# Altium schematic sheet pca10090_sheet5_signal_switches.SchDoc: PCA10090 - Signal switches
size A3; Organization: Nordic Semiconductor; DocumentNumber: 5; SheetNumber: 5; SheetTotal: 8; CompanyName: Nordic Semiconductor; DocumentSize: A3
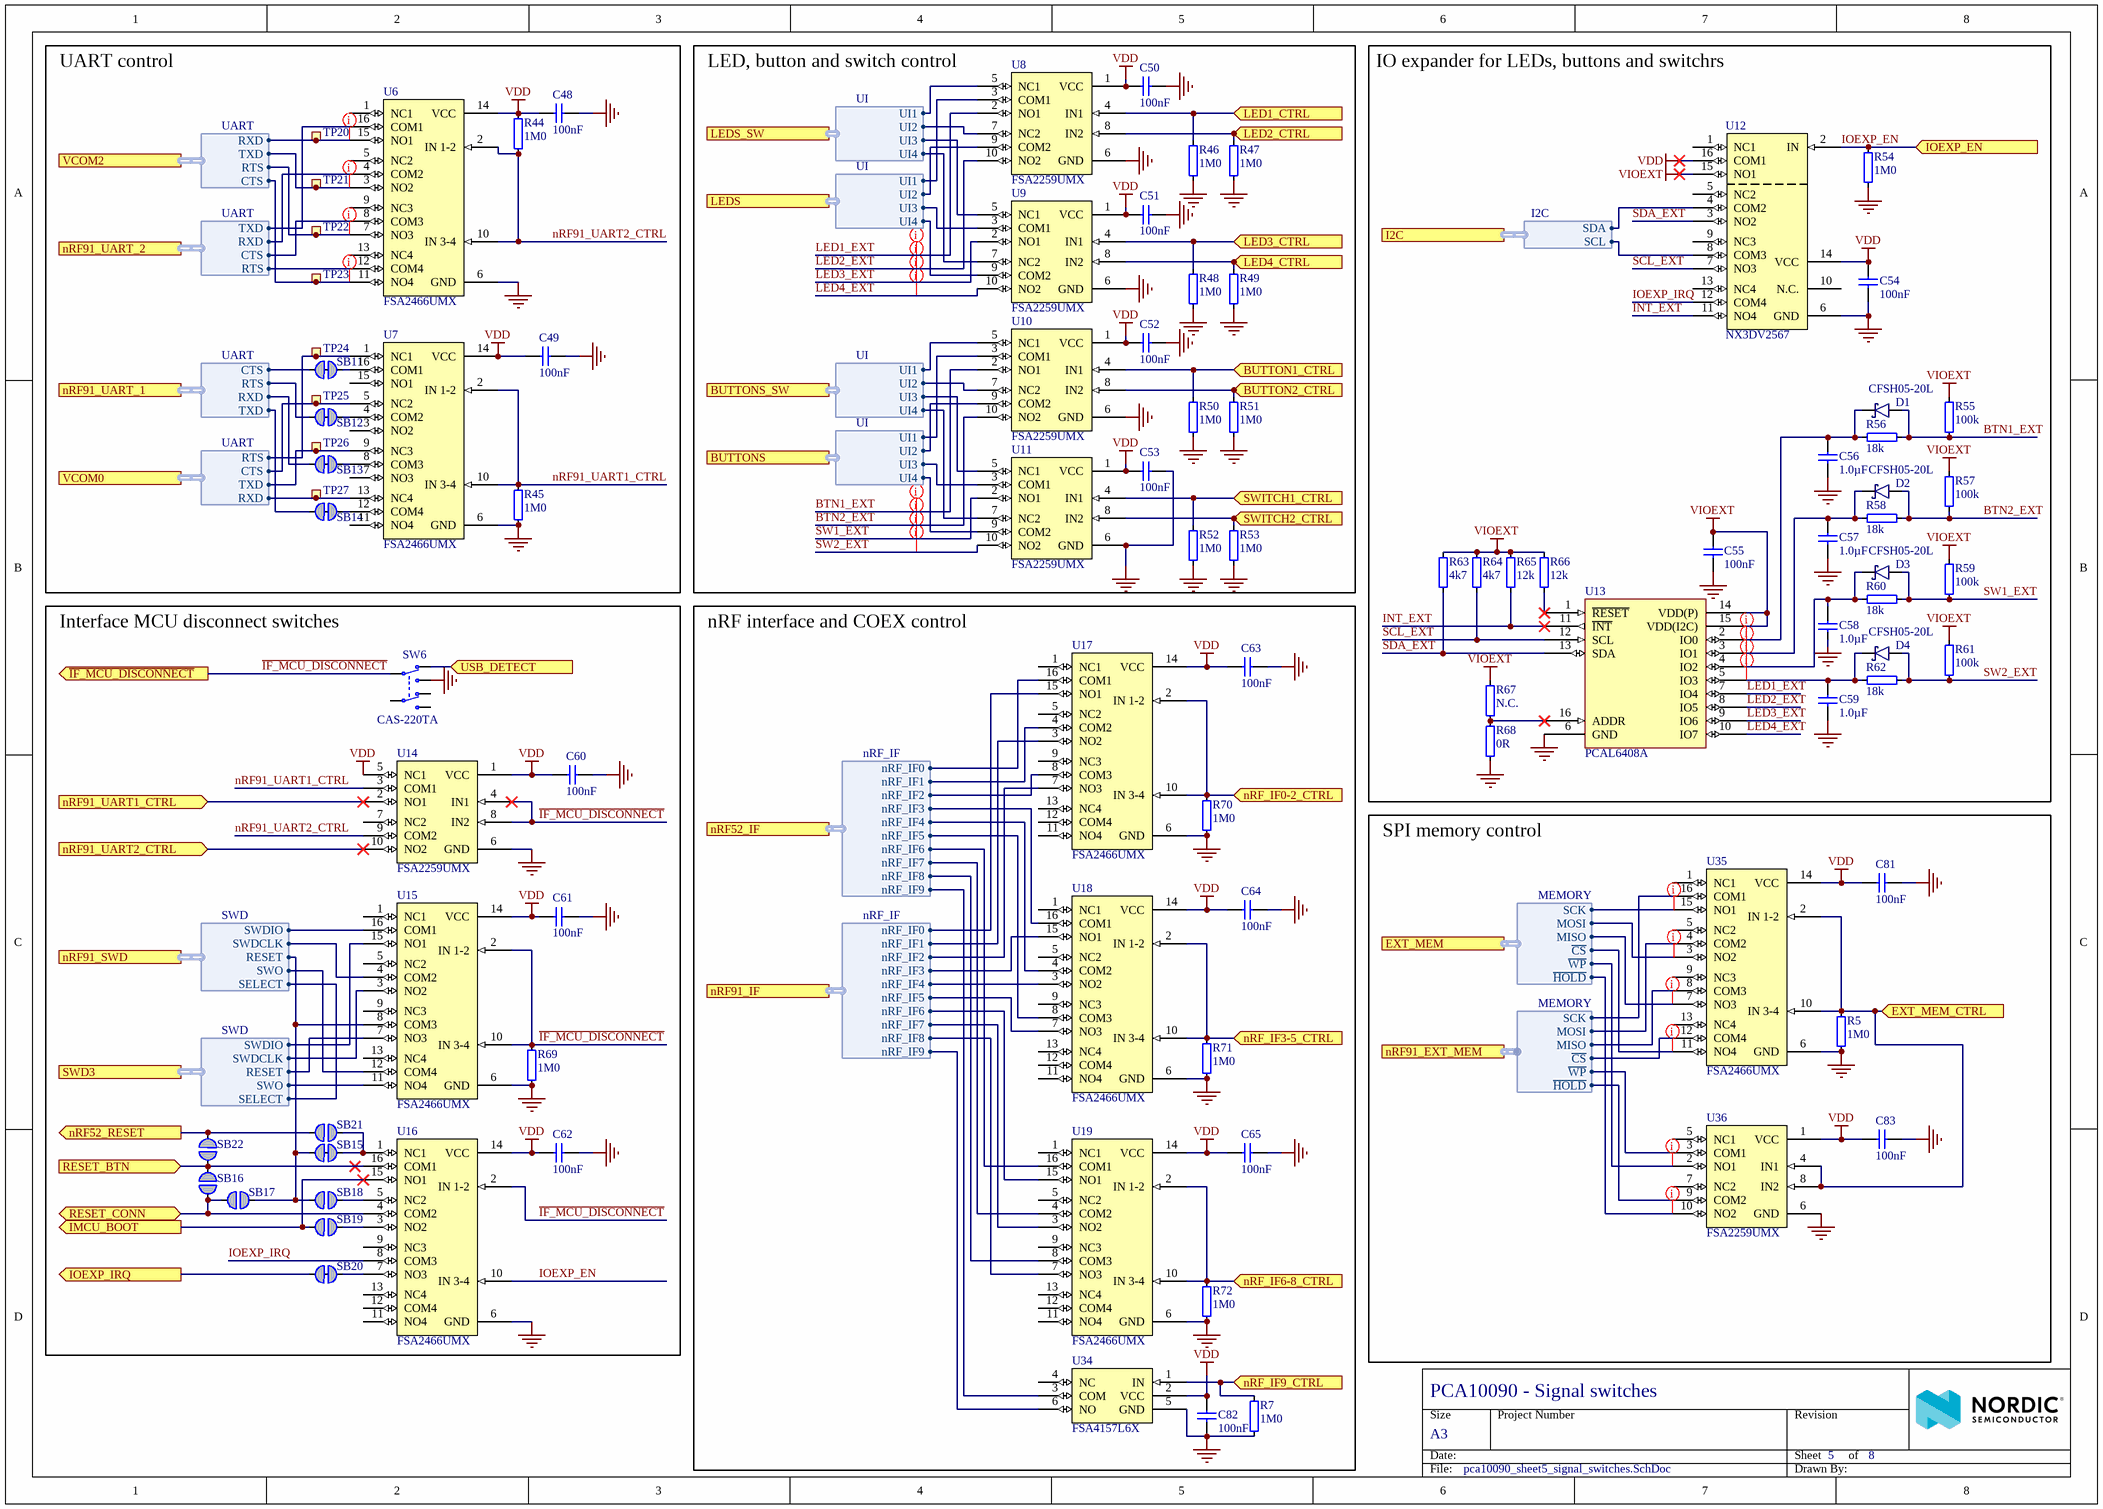
[diagram p0: pca10090_sheet5_signal_switches.SchDoc]

## Parts
C48  100nF  [CAPC0603X03L_C]
C49  100nF  [CAPC0603X03L_C]
C50  100nF  [CAPC0603X03L_C]
C51  100nF  [CAPC0603X03L_C]
C52  100nF  [CAPC0603X03L_C]
C53  100nF  [CAPC0603X03L_C]
C54  100nF  [CAPC0603X03L_C]
C55  100nF  [CAPC0603X03L_C]
C56  1.0µF  [CAPC0603X03L_C]
C57  1.0µF  [CAPC0603X03L_C]
C58  1.0µF  [CAPC0603X03L_C]
C59  1.0µF  [CAPC0603X03L_C]
C60  100nF  [CAPC0603X03L_C]
C61  100nF  [CAPC0603X03L_C]
C62  100nF  [CAPC0603X03L_C]
C63  100nF  [CAPC0603X03L_C]
C64  100nF  [CAPC0603X03L_C]
C65  100nF  [CAPC0603X03L_C]
C81  100nF  [CAPC0603X03L_C]
C82  100nF  [CAPC0603X03L_C]
C83  100nF  [CAPC0603X03L_C]
D1  CFSH05-20L  [SODFL35X40-2N]
D2  CFSH05-20L  [SODFL35X40-2N]
D3  CFSH05-20L  [SODFL35X40-2N]
D4  CFSH05-20L  [SODFL35X40-2N]
R5  1M0  [RESC0603X03L_C]
R7  1M0  [RESC0603X03L_C]
R44  1M0  [RESC0603X03L_C]
R45  1M0  [RESC0603X03L_C]
R46  1M0  [RESC0603X03L_C]
R47  1M0  [RESC0603X03L_C]
R48  1M0  [RESC0603X03L_C]
R49  1M0  [RESC0603X03L_C]
R50  1M0  [RESC0603X03L_C]
R51  1M0  [RESC0603X03L_C]
R52  1M0  [RESC0603X03L_C]
R53  1M0  [RESC0603X03L_C]
R54  1M0  [RESC0603X03L_C]
R55  100k  [RESC0603X03L_C]
R56  18k  [RESC0603X03L_C]
R57  100k  [RESC0603X03L_C]
R58  18k  [RESC0603X03L_C]
R59  100k  [RESC0603X03L_C]
R60  18k  [RESC0603X03L_C]
R61  100k  [RESC0603X03L_C]
R62  18k  [RESC0603X03L_C]
R63  4k7  [RESC0603X03L_C]
R64  4k7  [RESC0603X03L_C]
R65  12k  [RESC0603X03L_C]
R66  12k  [RESC0603X03L_C]
R67  N.C.  [RESC0603X03L_C_NC]
R68  0R  [RESC0603X03L_C]
R69  1M0  [RESC0603X03L_C]
R70  1M0  [RESC0603X03L_C]
R71  1M0  [RESC0603X03L_C]
R72  1M0  [RESC0603X03L_C]
SB11  Solderbridge  [Solderbridge_Shorted]  (value not drawn)  (net tie, no BOM)
SB12  Solderbridge  [Solderbridge_Shorted]  (value not drawn)  (net tie, no BOM)
SB13  Solderbridge  [Solderbridge_Shorted]  (value not drawn)  (net tie, no BOM)
SB14  Solderbridge  [Solderbridge_Shorted]  (value not drawn)  (net tie, no BOM)
SB15  Solderbridge  [Solderbridge_Shorted]  (value not drawn)  (net tie, no BOM)
SB16  Solderbridge  [Solderbridge]  (value not drawn)  (no BOM)
SB17  Solderbridge  [Solderbridge]  (value not drawn)  (no BOM)
SB18  Solderbridge  [Solderbridge]  (value not drawn)  (no BOM)
SB19  Solderbridge  [Solderbridge]  (value not drawn)  (no BOM)
SB20  Solderbridge  [Solderbridge_Shorted]  (value not drawn)  (net tie, no BOM)
SB21  Solderbridge  [Solderbridge]  (value not drawn)  (no BOM)
SB22  Solderbridge  [Solderbridge]  (value not drawn)  (no BOM)
SW6  CAS-220TA  [CAS-220TA]
TP20  Ø1.5mm,SMD  [TP_SMD_Ø1.5mm]  (value not drawn)  (no BOM)
TP21  Ø1.5mm,SMD  [TP_SMD_Ø1.5mm]  (value not drawn)  (no BOM)
TP22  Ø1.5mm,SMD  [TP_SMD_Ø1.5mm]  (value not drawn)  (no BOM)
TP23  Ø1.5mm,SMD  [TP_SMD_Ø1.5mm]  (value not drawn)  (no BOM)
TP24  Ø1.5mm,SMD  [TP_SMD_Ø1.5mm]  (value not drawn)  (no BOM)
TP25  Ø1.5mm,SMD  [TP_SMD_Ø1.5mm]  (value not drawn)  (no BOM)
TP26  Ø1.5mm,SMD  [TP_SMD_Ø1.5mm]  (value not drawn)  (no BOM)
TP27  Ø1.5mm,SMD  [TP_SMD_Ø1.5mm]  (value not drawn)  (no BOM)
U6  FSA2466UMX  [XQFN40P180X260X50-16N]
U7  FSA2466UMX  [XQFN40P180X260X50-16N]
U8  FSA2259UMX  [UFQFN40P140X180X55-10N]
U9  FSA2259UMX  [UFQFN40P140X180X55-10N]
U10  FSA2259UMX  [UFQFN40P140X180X55-10N]
U11  FSA2259UMX  [UFQFN40P140X180X55-10N]
U12  NX3DV2567  [XQFN40P180X260X50-16N]
U13  PCAL6408A  [XQFN40P180X260X50-16N]
U14  FSA2259UMX  [UFQFN40P140X180X55-10N]
U15  FSA2466UMX  [XQFN40P180X260X50-16N]
U16  FSA2466UMX  [XQFN40P180X260X50-16N]
U17  FSA2466UMX  [XQFN40P180X260X50-16N]
U18  FSA2466UMX  [XQFN40P180X260X50-16N]
U19  FSA2466UMX  [XQFN40P180X260X50-16N]
U34  FSA4157L6X  [PSON50P100X60-6N]
U35  FSA2466UMX  [XQFN40P180X260X50-16N]
U36  FSA2259UMX  [UFQFN40P140X180X55-10N]

## Blocks framed on the sheet
UART control: C48 C49 R44 R45 SB11-SB14 TP20-TP27 U6 U7
LED, button and switch control: C50-C53 R46-R53 U8-U11
IO expander for LEDs, buttons and switchrs: C54-C59 D1-D4 R54-R68 U12 U13
Interface MCU disconnect switches: C60-C62 R69 SB15-SB22 SW6 U14-U16
nRF interface and COEX control: C63-C65 C82 R7 R70-R72 U17-U19 U34
SPI memory control: C81 C83 R5 U35 U36

## Ports
BUTTON1_CTRL (in), BUTTON2_CTRL (in), BUTTONS (harness UI), BUTTONS_SW (harness UI), EXT_MEM (harness MEMORY), EXT_MEM_CTRL (in), I2C (harness I2C), IMCU_BOOT (out), IOEXP_EN (in), IOEXP_IRQ (out), LED1_CTRL (in), LED2_CTRL (in), LED3_CTRL (in), LED4_CTRL (in), LEDS (harness UI), LEDS_SW (harness UI), nRF52_IF (harness nRF_IF), nRF52_RESET (out), nRF91_EXT_MEM (harness MEMORY), nRF91_IF (harness nRF_IF), nRF91_SWD (harness SWD), nRF91_UART1_CTRL (in), nRF91_UART2_CTRL (in), nRF91_UART_1 (harness UART), nRF91_UART_2 (harness UART), nRF_IF0-2_CTRL (in), nRF_IF3-5_CTRL (in), nRF_IF6-8_CTRL (in), nRF_IF9_CTRL (in), RESET_BTN (in), RESET_CONN (bidir), SWD3 (harness SWD), SWITCH1_CTRL (in), SWITCH2_CTRL (in), USB_DETECT (in), VCOM0 (harness UART), VCOM2 (harness UART), ~{IF_MCU_DISCONNECT} (out)

## Harnesses
nRF_IF: nRF_IF0, nRF_IF1, nRF_IF2, nRF_IF3, nRF_IF4, nRF_IF5, nRF_IF6, nRF_IF7, nRF_IF8, nRF_IF9
SWD: SWDIO, SWDCLK, SWO, RESET, SELECT
UART: RTS, CTS, RXD, TXD
UI: UI4, UI3, UI2, UI1
I2C: SCL, SDA
MEMORY: SCK, ~{CS}, MOSI, MISO, ~{WP}, ~{HOLD}

## Nets
GND: C48.2 C49.2 C50.2 C51.2 C52.2 C53.2 C54.1 C55.1 C56.2 C57.1 C58.1 C59.1 C60.2 C61.2 C62.2 C63.2 C64.2 C65.2 C81.2 C82.2 C83.2 R5.1 R7.1 R45.1 R46.1 R47.1 R48.1 R49.1 R50.1 R51.1 R52.1 R53.1 R54.1 R68.1 R69.1 R70.1 R71.1 R72.1 SW6.1(N.O-1) U6.6(GND) U7.6(GND) U8.6(GND) U9.6(GND) U10.6(GND) U11.6(GND) U12.6(GND) U13.6(GND) U14.6(GND) U15.6(GND) U16.6(GND) U17.6(GND) U18.6(GND) U19.6(GND) U34.5(GND) U35.6(GND) U36.6(GND)
VDD: C48.1 C49.1 C50.1 C51.1 C52.1 C53.1 C54.2 C60.1 C61.1 C62.1 C63.1 C64.1 C65.1 C81.1 C82.1 C83.1 R44.1 U6.14(VCC) U7.14(VCC) U8.1(VCC) U9.1(VCC) U10.1(VCC) U11.1(VCC) U12.14(VCC) U12.16(COM1) U14.1(VCC) U14.5(NC1) U15.14(VCC) U16.14(VCC) U17.14(VCC) U18.14(VCC) U19.14(VCC) U34.2(VCC) U35.14(VCC) U36.1(VCC)
VIOEXT: C55.2 R55.2 R57.2 R59.2 R61.2 R63.2 R64.2 R65.2 R66.2 R67.2 U12.15(NO1) U13.14(VDD(P)) U13.15(VDD(I2C))
BTN1_EXT: D1.1(A) R55.1 R56.2 U10.2(NO1)
BTN2_EXT: D2.1(A) R57.1 R58.2 U10.10(NO2)
BUTTON1_CTRL: R50.2 U10.4(IN1) ; port BUTTON1_CTRL
BUTTON2_CTRL: R51.2 U10.8(IN2) ; port BUTTON2_CTRL
EXT_MEM_CTRL: R5.2 U35.2(IN_1-2) U35.10(IN_3-4) U36.4(IN1) U36.8(IN2) ; port EXT_MEM_CTRL
~{IF_MCU_DISCONNECT}: R69.2 SW6.2(COM-1) U14.4(IN1) U14.8(IN2) U15.2(IN_1-2) U15.10(IN_3-4) U16.2(IN_1-2) ; port ~{IF_MCU_DISCONNECT}
IMCU_BOOT: SB19.2 U16.15(NO1) ; port IMCU_BOOT
INT_EXT: R65.1 U12.11(NO4) U13.11(~{INT})
IOEXP_EN: R54.2 U12.2(IN) U16.10(IN_3-4) ; port IOEXP_EN
IOEXP_IRQ: U12.12(COM4) U16.8(COM3)
IOEXP_IRQ: SB20.2 ; port IOEXP_IRQ  [a separate net that carries the same name]
LED1_CTRL: R46.2 U8.4(IN1) ; port LED1_CTRL
LED1_EXT: U8.2(NO1) U13.7(IO4)
LED2_CTRL: R47.2 U8.8(IN2) ; port LED2_CTRL
LED2_EXT: U8.10(NO2) U13.8(IO5)
LED3_CTRL: R48.2 U9.4(IN1) ; port LED3_CTRL
LED3_EXT: U9.2(NO1) U13.9(IO6)
LED4_CTRL: R49.2 U9.8(IN2) ; port LED4_CTRL
LED4_EXT: U9.10(NO2) U13.10(IO7)
nRF52_RESET: SB21.1 SB22.2 ; port nRF52_RESET
nRF91_UART1_CTRL: U14.2(NO1) ; port nRF91_UART1_CTRL
nRF91_UART1_CTRL: R45.2 U7.2(IN_1-2) U7.10(IN_3-4) U14.3(COM1)  [a separate net that carries the same name]
nRF91_UART2_CTRL: R44.2 U6.2(IN_1-2) U6.10(IN_3-4) U14.9(COM2)
nRF91_UART2_CTRL: U14.10(NO2) ; port nRF91_UART2_CTRL  [a separate net that carries the same name]
nRF_IF0-2_CTRL: R70.2 U17.2(IN_1-2) U17.10(IN_3-4) ; port nRF_IF0-2_CTRL
nRF_IF3-5_CTRL: R71.2 U18.2(IN_1-2) U18.10(IN_3-4) ; port nRF_IF3-5_CTRL
nRF_IF6-8_CTRL: R72.2 U19.2(IN_1-2) U19.10(IN_3-4) ; port nRF_IF6-8_CTRL
nRF_IF9_CTRL: R7.2 U34.1(IN) ; port nRF_IF9_CTRL
RESET_BTN: SB16.1 SB22.1 U16.16(COM1) ; port RESET_BTN
RESET_CONN: SB16.2 SB17.1 U16.4(COM2) ; port RESET_CONN
SCL_EXT: R64.1 U12.7(NO3) U13.12(SCL)
SDA_EXT: R63.1 U12.3(NO2) U13.13(SDA)
SW1_EXT: D3.1(A) R59.1 R60.2 U11.2(NO1)
SW2_EXT: D4.1(A) R61.1 R62.2 U11.10(NO2)
SWITCH1_CTRL: R52.2 U11.4(IN1) ; port SWITCH1_CTRL
SWITCH2_CTRL: R53.2 U11.8(IN2) ; port SWITCH2_CTRL
USB_DETECT: SW6.3(N.C-1) ; port USB_DETECT
NetC56_1: C56.1 D1.3(C) R56.1 U13.2(IO0)
NetC57_2: C57.2 D2.3(C) R58.1 U13.3(IO1)
NetC58_2: C58.2 D3.3(C) R60.1 U13.4(IO2)
NetC59_2: C59.2 D4.3(C) R62.1 U13.5(IO3)
NetR66_1: R66.1 U13.1(~{RESET})
NetR67_1: R67.1 R68.2 U13.16(ADDR)
NetSB11_1: SB11.1 ; port nRF91_UART_1.CTS
NetSB11_2: SB11.2 U7.16(COM1)
NetSB12_1: SB12.1 ; port nRF91_UART_1.RTS
NetSB12_2: SB12.2 U7.4(COM2)
NetSB13_1: SB13.1 ; port nRF91_UART_1.RXD
NetSB13_2: SB13.2 U7.8(COM3)
NetSB14_1: SB14.1 ; port nRF91_UART_1.TXD
NetSB14_2: SB14.2 U7.12(COM4)
NetSB15_1: SB15.1 SB21.2 U16.1(NC1)
NetSB15_2: SB15.2 SB17.2 SB18.2 U15.8(COM3) ; port nRF91_SWD.RESET
NetSB18_1: SB18.1 U16.5(NC2)
NetSB19_1: SB19.1 U16.3(NO2)
NetSB20_1: SB20.1 U16.7(NO3)
NetTP20_1: TP20.1 U6.15(NO1) ; port VCOM2.RXD
NetTP21_1: TP21.1 U6.3(NO2) ; port VCOM2.TXD
NetTP22_1: TP22.1 U6.7(NO3) ; port VCOM2.RTS
NetTP23_1: TP23.1 U6.11(NO4) ; port VCOM2.CTS
NetTP24_1: TP24.1 U7.1(NC1) ; port VCOM0.RTS
NetTP25_1: TP25.1 U7.5(NC2) ; port VCOM0.CTS
NetTP26_1: TP26.1 U7.9(NC3) ; port VCOM0.TXD
NetTP27_1: TP27.1 U7.13(NC4) ; port VCOM0.RXD
NetU6_4: U6.4(COM2) ; port nRF91_UART_2.RXD
NetU6_8: U6.8(COM3) ; port nRF91_UART_2.CTS
NetU6_12: U6.12(COM4) ; port nRF91_UART_2.RTS
NetU6_16: U6.16(COM1) ; port nRF91_UART_2.TXD
NetU8_3: U8.3(COM1) ; port LEDS.UI1
NetU8_5: U8.5(NC1) ; port LEDS_SW.UI1
NetU8_7: U8.7(NC2) ; port LEDS_SW.UI2
NetU8_9: U8.9(COM2) ; port LEDS.UI2
NetU9_3: U9.3(COM1) ; port LEDS.UI3
NetU9_5: U9.5(NC1) ; port LEDS_SW.UI3
NetU9_7: U9.7(NC2) ; port LEDS_SW.UI4
NetU9_9: U9.9(COM2) ; port LEDS.UI4
NetU10_3: U10.3(COM1) ; port BUTTONS.UI1
NetU10_5: U10.5(NC1) ; port BUTTONS_SW.UI1
NetU10_7: U10.7(NC2) ; port BUTTONS_SW.UI2
NetU10_9: U10.9(COM2) ; port BUTTONS.UI2
NetU11_3: U11.3(COM1) ; port BUTTONS.UI3
NetU11_5: U11.5(NC1) ; port BUTTONS_SW.UI3
NetU11_7: U11.7(NC2) ; port BUTTONS_SW.UI4
NetU11_9: U11.9(COM2) ; port BUTTONS.UI4
NetU12_4: U12.4(COM2) ; port I2C.SDA
NetU12_8: U12.8(COM3) ; port I2C.SCL
NetU15_3: U15.3(NO2) ; port SWD3.SWDCLK
NetU15_4: U15.4(COM2) ; port nRF91_SWD.SWDCLK
NetU15_7: U15.7(NO3) ; port SWD3.RESET
NetU15_11: U15.11(NO4) ; port SWD3.SWO
NetU15_12: U15.12(COM4) ; port nRF91_SWD.SWO
NetU15_15: U15.15(NO1) ; port SWD3.SWDIO
NetU15_16: U15.16(COM1) ; port nRF91_SWD.SWDIO
NetU17_3: U17.3(NO2) ; port nRF91_IF.nRF_IF1
NetU17_4: U17.4(COM2) ; port nRF52_IF.nRF_IF1
NetU17_7: U17.7(NO3) ; port nRF91_IF.nRF_IF2
NetU17_8: U17.8(COM3) ; port nRF52_IF.nRF_IF2
NetU17_15: U17.15(NO1) ; port nRF91_IF.nRF_IF0
NetU17_16: U17.16(COM1) ; port nRF52_IF.nRF_IF0
NetU18_3: U18.3(NO2) ; port nRF91_IF.nRF_IF4
NetU18_4: U18.4(COM2) ; port nRF52_IF.nRF_IF4
NetU18_7: U18.7(NO3) ; port nRF91_IF.nRF_IF5
NetU18_8: U18.8(COM3) ; port nRF52_IF.nRF_IF5
NetU18_15: U18.15(NO1) ; port nRF91_IF.nRF_IF3
NetU18_16: U18.16(COM1) ; port nRF52_IF.nRF_IF3
NetU19_3: U19.3(NO2) ; port nRF91_IF.nRF_IF7
NetU19_4: U19.4(COM2) ; port nRF52_IF.nRF_IF7
NetU19_7: U19.7(NO3) ; port nRF91_IF.nRF_IF8
NetU19_8: U19.8(COM3) ; port nRF52_IF.nRF_IF8
NetU19_15: U19.15(NO1) ; port nRF91_IF.nRF_IF6
NetU19_16: U19.16(COM1) ; port nRF52_IF.nRF_IF6
NetU34_3: U34.3(COM) ; port nRF52_IF.nRF_IF9
NetU34_6: U34.6(NO) ; port nRF91_IF.nRF_IF9
NetU35_3: U35.3(NO2) ; port EXT_MEM.MOSI
NetU35_4: U35.4(COM2) ; port nRF91_EXT_MEM.MOSI
NetU35_7: U35.7(NO3) ; port EXT_MEM.MISO
NetU35_8: U35.8(COM3) ; port nRF91_EXT_MEM.MISO
NetU35_11: U35.11(NO4) ; port EXT_MEM.~{CS}
NetU35_12: U35.12(COM4) ; port nRF91_EXT_MEM.~{CS}
NetU35_15: U35.15(NO1) ; port EXT_MEM.SCK
NetU35_16: U35.16(COM1) ; port nRF91_EXT_MEM.SCK
NetU36_2: U36.2(NO1) ; port EXT_MEM.~{WP}
NetU36_3: U36.3(COM1) ; port nRF91_EXT_MEM.~{WP}
NetU36_9: U36.9(COM2) ; port nRF91_EXT_MEM.~{HOLD}
NetU36_10: U36.10(NO2) ; port EXT_MEM.~{HOLD}
(unnamed): port nRF91_SWD.SELECT, port SWD3.SELECT

Not connected (* = marked no-connect by the designer): SW6 4(N.O-2) 5(COM-2) 6(N.C-2); U6 1(NC1) 5(NC2) 9(NC3) 13(NC4); U7 3(NO2) 7(NO3) 11(NO4) 15(NO1); U12 1(NC1) 5(NC2) 9(NC3) 10(N.C.) 13(NC4); U14 7(NC2); U15 1(NC1) 5(NC2) 9(NC3) 13(NC4); U16 9(NC3) 11(NO4) 12(COM4) 13(NC4); U17 1(NC1) 5(NC2) 9(NC3) 11(NO4) 12(COM4) 13(NC4); U18 1(NC1) 5(NC2) 9(NC3) 11(NO4) 12(COM4) 13(NC4); U19 1(NC1) 5(NC2) 9(NC3) 11(NO4) 12(COM4) 13(NC4); U34 4(NC); U35 1(NC1) 5(NC2) 9(NC3) 13(NC4); U36 5(NC1) 7(NC2)

## Layout directives
net class UART: NetTP20_1, NetTP21_1, NetTP22_1, NetTP23_1
net class GPIO: (no net found under the mark), BTN1_EXT, BTN2_EXT, LED1_EXT, LED2_EXT, LED3_EXT, LED4_EXT, NetC56_1, NetC57_2, NetC58_2, NetC59_2, NetU35_7, NetU35_11, NetU36_2, NetU36_10, SW1_EXT, SW2_EXT

## Notes on the sheet
- Size
- Date:
- A3
- Project Number
- Sheet         of
- Revision
- File:
- Drawn By:

## Library data of the parts
C48-C55 C60-C65 C81-C83 = C0201-100n: Capacitor, X5R, ±10%; Part number IPS: 00000001248, 00000002505; Note: 16V; Artikkelnr Noca: N.A.; Part Number: C0201-100n; Manufacturer: *; Manufacturer Part Number: *; ComponentLink1URL: *; ComponentLink1Description: Datasheet; ComponentLink2URL: *; ComponentLink2Description: Supplier link; HelpURL: *; Footprint Doc: 0201; LatestRevisionDate: 2017-11-09; Pin Count: 2; Publisher: Nordic Semiconductor; Published: 2014-11-13; Value: 100nF; Supplier 1: *; Supplier Part Number 1: *; Supplier 2: *; Supplier Part Number 2: *
C56-C59 = C0201-1µ0: Capacitor, X5R, ±10%; Part number IPS: 00000001723; Note: 10V; Artikkelnr Noca: N.A.; Part Number: C0201-1µ0; Manufacturer: *; Manufacturer Part Number: *; Footprint Doc: 0201; LatestRevisionDate: 2016-08-22; Pin Count: 2; Publisher: Nordic Semiconductor; Published: 2009-05-08; Value: 1.0µF; ComponentLink1URL: *; ComponentLink1Description: Datasheet; ComponentLink2URL: *; ComponentLink2Description: Supplier link; HelpURL: *; Supplier 1: Digi-Key; Supplier Part Number 1: 1276-6795-1-ND; Supplier 2: *; Supplier Part Number 2: *
D1-D4 = CFSH05-20L: DIODE SCHOTTKY 20V 500MA SOD882; Manufacturer: Central Semiconductor Corp.; Part number IPS: 00000002493; Artikkelnr Noca: N.A.; Part Number: CFSH05-20L; Manufacturer Part Number: CFSH05-20L; Footprint Doc: SOD-882L; LatestRevisionDate: 2015-01-30; Pin Count: 2; Publisher: Nordic Semiconductor; Published: 2015-01-30; Value: CFSH05-20L; Note: *; ComponentLink1URL: *; ComponentLink1Description: Datasheet; ComponentLink2URL: *; ComponentLink2Description: Supplier link; HelpURL: http://www.centralsemi.com/PDFs/products/CFSH05-20L.PDF; Supplier 1: Digi-Key; Supplier Part Number 1: CFSH05-20L CT-ND; Supplier 2: *; Supplier Part Number 2: *
R5 R7 R44-R54 R69-R72 = R0201-1M0: Resistor, ±1%, 0.05W; Part number IPS: 00000001418; Note: Chip Res 1%; Artikkelnr Noca: N.A.; Part Number: R0201-1M0; Manufacturer: *; Manufacturer Part Number: *; ComponentLink1URL: *; ComponentLink1Description: Datasheet; ComponentLink2URL: *; ComponentLink2Description: Supplier link; HelpURL: *; Footprint Doc: 0201; LatestRevisionDate: 2014-11-13; Pin Count: 2; Publisher: Nordic Semiconductor; Published: 2014-11-13; Value: 1M0; Supplier 1: *; Supplier Part Number 1: *; Supplier 2: *; Supplier Part Number 2: *
R55 R57 R59 R61 = R0201-100k: Resistor, ±1%, 0.05W; Part number IPS: 00000001419; Note: Chip Res 1%; Artikkelnr Noca: N.A.; Part Number: R0201-100k; Manufacturer: *; Manufacturer Part Number: *; Footprint Doc: 0201; LatestRevisionDate: 2014-11-13; Pin Count: 2; Publisher: Nordic Semiconductor; Published: 2014-11-13; Value: 100k; ComponentLink1URL: *; ComponentLink1Description: Datasheet; ComponentLink2URL: *; ComponentLink2Description: Supplier link; HelpURL: *; Supplier 1: *; Supplier Part Number 1: *; Supplier 2: *; Supplier Part Number 2: *
R56 R58 R60 R62 = R0201-18k: Resistor, ±1%, 0.05W; Part number IPS: 00000001707; Note: Chip Res 1%; Artikkelnr Noca: N.A.; Part Number: R0201-18k; Manufacturer: *; Manufacturer Part Number: *; Footprint Doc: 0201; LatestRevisionDate: 2014-11-13; Pin Count: 2; Publisher: Nordic Semiconductor; Published: 2014-11-13; Value: 18k; ComponentLink1URL: *; ComponentLink1Description: Datasheet; ComponentLink2URL: *; ComponentLink2Description: Supplier link; HelpURL: *; Supplier 1: *; Supplier Part Number 1: *; Supplier 2: *; Supplier Part Number 2: *
R63 R64 = R0201-4k7: Resistor, ±1%, 0.05W; Part number IPS: 00000001706; Note: Chip Res 1%; Artikkelnr Noca: N.A.; Part Number: R0201-4k7; Manufacturer: *; Manufacturer Part Number: *; Footprint Doc: 0201; LatestRevisionDate: 2014-11-13; Pin Count: 2; Publisher: Nordic Semiconductor; Published: 2014-11-13; Value: 4k7; ComponentLink1URL: *; ComponentLink1Description: Datasheet; ComponentLink2URL: *; ComponentLink2Description: Supplier link; HelpURL: *; Supplier 1: *; Supplier Part Number 1: *; Supplier 2: *; Supplier Part Number 2: *
R65 R66 = R0201-12k: Resistor, ±1%, 0.05W; Part number IPS: 00000007891; Note: Chip Res 1%; Artikkelnr Noca: N.A.; Part Number: R0201-12k; Manufacturer: *; Manufacturer Part Number: *; Footprint Doc: 0201; LatestRevisionDate: 2014-11-13; Pin Count: 2; Publisher: Nordic Semiconductor; Published: 2014-11-13; Value: 12k; ComponentLink1URL: *; ComponentLink1Description: Datasheet; ComponentLink2URL: *; ComponentLink2Description: Supplier link; HelpURL: *; Supplier 1: *; Supplier Part Number 1: *; Supplier 2: *; Supplier Part Number 2: *
R67 = R0201-N.C.: Not mounted; Note: Chip Res; Artikkelnr Noca: N.A.; Assembly: Not mounted; Part Number: R0201-N.C.; Manufacturer: *; Manufacturer Part Number: *; Footprint Doc: 0201; LatestRevisionDate: 2014-11-13; Pin Count: 2; Publisher: Nordic Semiconductor; Published: 2014-11-13; Value: N.C.; Part number IPS: N.A.; ComponentLink1URL: *; ComponentLink1Description: Datasheet; ComponentLink2URL: *; ComponentLink2Description: Supplier link; HelpURL: *; Supplier 1: *; Supplier Part Number 1: *; Supplier 2: *; Supplier Part Number 2: *
R68 = R0201-0R: Resistor, ±5%, 0.05W; Part number IPS: 00000003245; Note: Chip Res 5%; Artikkelnr Noca: N.A.; Part Number: R0201-0R; Manufacturer: *; Manufacturer Part Number: *; Footprint Doc: 0201; LatestRevisionDate: 2017-11-09; Pin Count: 2; Publisher: Nordic Semiconductor; Published: 2014-11-13; Value: 0R; ComponentLink1URL: *; ComponentLink1Description: Datasheet; ComponentLink2URL: *; ComponentLink2Description: Supplier link; HelpURL: *; Supplier 1: *; Supplier Part Number 1: *; Supplier 2: *; Supplier Part Number 2: *
SB11-SB14 = Solderbridge Shorted: Shorted Solderbridge; Artikkelnr Noca: N.A.; Part Number: Solderbridge Shorted; Manufacturer: *; Manufacturer Part Number: *; Footprint Doc: Solderbridge_Shorted; LatestRevisionDate: 2012-08-07; Pin Count: 2; Publisher: Nordic Semiconductor; Published: 2012-08-07; Value: Solderbridge; Note: *; Part number IPS: N.A.; ComponentLink1URL: *; ComponentLink1Description: Datasheet; ComponentLink2URL: *; ComponentLink2Description: Supplier link; HelpURL: *; Supplier 1: *; Supplier Part Number 1: *; Supplier 2: *; Supplier Part Number 2: *
SB15 SB20 = Solderbridge shorted: Shorted Solderbridge; Artikkelnr Noca: N.A.; Part Number: Solderbridge Shorted; Manufacturer: *; Manufacturer Part Number: *; Footprint Doc: Solderbridge_Shorted; LatestRevisionDate: 2012-08-07; Pin Count: 2; Publisher: Nordic Semiconductor; Published: 2012-08-07; Value: Solderbridge; Note: *; Part number IPS: N.A.; ComponentLink1URL: *; ComponentLink1Description: Datasheet; ComponentLink2URL: *; ComponentLink2Description: Supplier link; HelpURL: *; Supplier 1: *; Supplier Part Number 1: *; Supplier 2: *; Supplier Part Number 2: *
SB16-SB19 SB21 SB22 = Solderbridge: Artikkelnr Noca: N.A.; Part Number: Solderbridge; Manufacturer: *; Manufacturer Part Number: *; Footprint Doc: Solderbridge; LatestRevisionDate: 2009-12-14; Pin Count: 2; Publisher: Nordic Semiconductor; Published: 2009-12-14; Value: Solderbridge; Note: *; Part number IPS: N.A.; ComponentLink1URL: *; ComponentLink1Description: Datasheet; ComponentLink2URL: *; ComponentLink2Description: Supplier link; HelpURL: *; Supplier 1: *; Supplier Part Number 1: *; Supplier 2: *; Supplier Part Number 2: *
SW6 = CAS-220TA: Slide Switch DPDT J Hook; Manufacturer: Copal Electronics Inc; Part number IPS: 00000009983; Artikkelnr Noca: 50019042; Part Number: CAS-220TA; Manufacturer Part Number: CAS-220TA; Footprint Doc: CAS-220TA; LatestRevisionDate: 2010-02-18; Pin Count: 6; Publisher: Nordic Semiconductor; Published: 2010-02-18; Value: CAS-220TA; Note: *; ComponentLink1URL: *; ComponentLink1Description: Datasheet; ComponentLink2URL: *; ComponentLink2Description: Supplier link; HelpURL: http://media.digikey.com/pdf/Data%20Sheets/COPAL%20Electronics%20PDFs/CAS%20SMD%20Slide%20Switch.pdf; Supplier 1: Digi-Key; Supplier Part Number 1: CAS220JTR-ND; Supplier 2: *; Supplier Part Number 2: *
TP20-TP27 = TP_SMD_Ø1.5MM: 1.5mm circular SMD testpad; Manufacturer: Nordic Semiconductor; Artikkelnr Noca: N.A.; Part Number: TP_SMD_Ø1.5MM; Manufacturer Part Number: *; ComponentLink1URL: *; ComponentLink1Description: Datasheet; ComponentLink2URL: *; ComponentLink2Description: Supplier link; HelpURL: *; Footprint Doc: TP_SMD_Ø1.5mm; LatestRevisionDate: 2016-06-02; Pin Count: 1; Publisher: Nordic Semiconductor; Published: 2016-06-02; Value: Ø1.5mm,SMD; Note: *; Supplier 1: *; Supplier Part Number 1: *; Supplier 2: *; Supplier Part Number 2: *; Part number IPS: N.A.
U6 U7 U15-U19 U35 = FSA2466UMX: Data / Audio Low-Voltage Dual DPDT Analog Switch; Manufacturer: ON Semiconductor; Part number IPS: 00000009986; Artikkelnr Noca: 15070069; Part Number: FSA2466UMX; Manufacturer Part Number: FSA2466UMX; ComponentLink1URL: *; ComponentLink1Description: Datasheet; ComponentLink2URL: *; ComponentLink2Description: Supplier link; HelpURL: https://www.onsemi.com/pub/Collateral/FSA2466-D.PDF; Footprint Doc: UFQFN-16; LatestRevisionDate: 2019-05-15; Pin Count: 16; Publisher: Nordic Semiconductor; Published: 2016-05-18; Value: FSA2466UMX; Note: *; Supplier 1: Digi-Key; Supplier Part Number 1: FSA2466UMXCT-ND; Supplier 2: Mouser; Supplier Part Number 2: 512-FSA2466UMX
U8-U11 U14 U36 = FSA2259UMX: Low-Voltage, Dual-SPDT analog Switch; Manufacturer: ON Semiconductor; Part number IPS: 00000002998; Artikkelnr Noca: N.A.; Part Number: FSA2259UMX; Manufacturer Part Number: FSA2259UMX; ComponentLink1URL: *; ComponentLink1Description: Datasheet; ComponentLink2URL: *; ComponentLink2Description: Supplier link; HelpURL: https://www.onsemi.com/pub/Collateral/FSA2259-D.PDF; Footprint Doc: UFQFN-10; LatestRevisionDate: 2019-05-15; Pin Count: 10; Publisher: Nordic Semiconductor; Published: 2019-05-15; Value: FSA2259UMX; Note: *; Supplier 1: Digi-Key; Supplier Part Number 1: FSA2259UMXCT-ND; Supplier 2: *; Supplier Part Number 2: *
U12 = NX3DV2567GU: Low-ohmic four-pole double-throw analog switch; Manufacturer: NXP Semiconductors; Part number IPS: 00000007816; Artikkelnr Noca: 15079317; Part Number: NX3DV2567GU; Manufacturer Part Number: NX3DV2567GU; Footprint Doc: XQFN-16; LatestRevisionDate: 2015-02-17; Pin Count: 16; Publisher: Nordic Semiconductor; Published: 2015-02-17; Value: NX3DV2567; Note: *; ComponentLink1URL: *; ComponentLink1Description: Datasheet; ComponentLink2URL: *; ComponentLink2Description: Supplier link; HelpURL: http://www.nxp.com/documents/data_sheet/NX3DV2567.pdf; Supplier 1: Digi-Key; Supplier Part Number 1: 568-5206-1-ND; Supplier 2: Mouser; Supplier Part Number 2: 771-NX3DV2567GU115
U13 = PCAL6408AHK: 8-bit I2C-bus I/O expander with interrupt output; Manufacturer: NXP Semiconductors; Part number IPS: 00000009987; Artikkelnr Noca: 15079321; Part Number: PCAL6408AHK; Manufacturer Part Number: PCAL6408AHK; Footprint Doc: XQFN-16; LatestRevisionDate: 2015-04-29; Pin Count: 16; Publisher: Nordic Semiconductor; Published: 2015-04-29; Value: PCAL6408A; Note: *; ComponentLink1URL: *; ComponentLink1Description: Datasheet; ComponentLink2URL: *; ComponentLink2Description: Supplier link; HelpURL: http://www.nxp.com/documents/data_sheet/PCAL6408A.pdf; Supplier 1: Digi-Key; Supplier Part Number 1: 568-9944-1-ND; Supplier 2: Mouser; Supplier Part Number 2: 771-PCAL6408AHKX
U34 = FSA4157L6X: Low-Voltage, SPDT Analog Switch, 1.65 V to 5.5 V; Manufacturer: ON Semiconductor; Artikkelnr Noca: N.A.; Part Number: FSA4157L6X; Manufacturer Part Number: FSA4157L6X; ComponentLink1URL: https://www.onsemi.com/pub/Collateral/FSA4157-D.pdf; ComponentLink1Description: Datasheet; ComponentLink2URL: https://www.digikey.com/product-detail/en/on-semiconductor/FSA4157L6X/FSA4157L6XCT-ND/821004; ComponentLink2Description: Supplier link; HelpURL: https://www.onsemi.com/pub/Collateral/FSA4157-D.pdf; Footprint Doc: UFDFN-6; LatestRevisionDate: 2019-10-22; Pin Count: 6; Publisher: Nordic Semiconductor; Published: 2019-10-22; Value: FSA4157L6X; Note: *; Supplier 1: Digi-Key; Supplier Part Number 1: FSA4157L6XCT-ND; Supplier 2: Mouser; Supplier Part Number 2: 512-FSA4157L6X; Part number IPS: N.A.